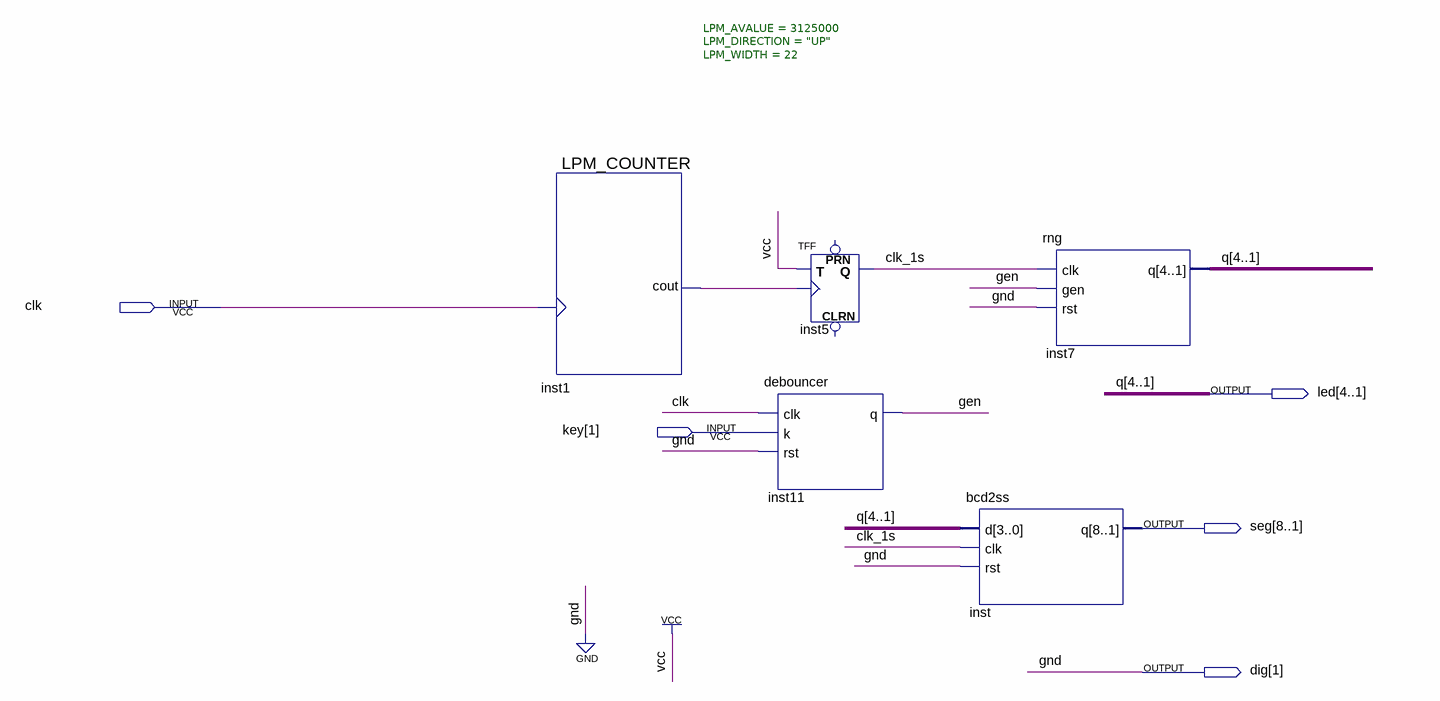
[diagram p0: schematic sheet]
// Quartus schematic test_rng.bdf as structural Verilog: 5 symbols, 5 pins
module test_rng (
  input  clk,
  input  [1:1] key,
  output [4:1] led,
  output [8:1] seg,
  output [1:1] dig
);

  wire clk_1s, gen, inst1_cout;

  LPM_COUNTER #(.LPM_AVALUE(3125000), .LPM_DIRECTION("UP"), .LPM_WIDTH(22)) inst1 (.clock(clk), .cout(inst1_cout));
  debouncer inst11 (.clk(clk), .k(key[1]), .rst(1'b0), .q(gen));
  TFF inst5 (.T(1'b1), .CLK(inst1_cout), .Q(clk_1s));  // open: PRN, CLRN
  bcd2ss inst (.d(led), .clk(clk_1s), .rst(1'b0), .q(seg));
  rng inst7 (.clk(clk_1s), .gen(gen), .rst(1'b0), .q(led));

  assign dig[1] = 1'b0;

  // Other names for the same wires on the sheet: q[4:1] = led
endmodule
